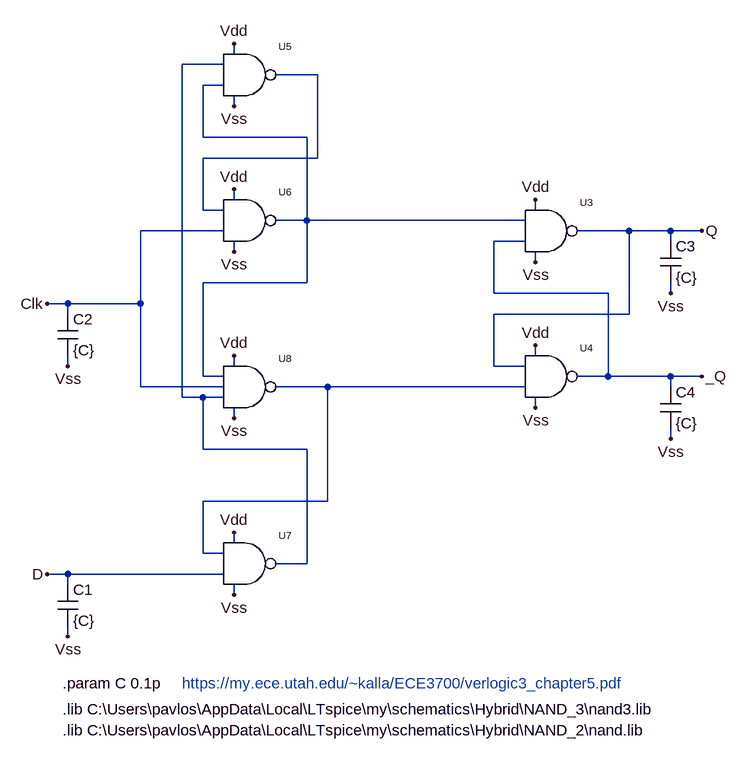
[diagram p0: schematic DFF_p.asc]
DFF_p.asc, the LTspice schematic file:
Version 4
SHEET 1 880 680
WIRE -464 -720 -464 -736
WIRE -480 -704 -544 -704
WIRE -336 -688 -400 -688
WIRE -480 -672 -512 -672
WIRE -464 -640 -464 -656
WIRE -512 -592 -512 -672
WIRE -352 -592 -512 -592
WIRE -336 -560 -336 -688
WIRE -336 -560 -512 -560
WIRE -464 -496 -464 -512
WIRE -512 -480 -512 -560
WIRE -480 -480 -512 -480
WIRE 0 -480 0 -496
WIRE -352 -464 -352 -592
WIRE -352 -464 -400 -464
WIRE -16 -464 -352 -464
WIRE -480 -448 -608 -448
WIRE 144 -448 64 -448
WIRE 208 -448 144 -448
WIRE 256 -448 208 -448
WIRE -16 -432 -64 -432
WIRE 208 -432 208 -448
WIRE -464 -416 -464 -432
WIRE 0 -400 0 -416
WIRE -352 -368 -352 -464
WIRE -352 -368 -512 -368
WIRE -64 -352 -64 -432
WIRE 112 -352 -64 -352
WIRE 208 -352 208 -368
WIRE -720 -336 -752 -336
WIRE -608 -336 -608 -448
WIRE -608 -336 -720 -336
WIRE -720 -320 -720 -336
WIRE 144 -320 144 -448
WIRE 144 -320 -64 -320
WIRE 0 -256 0 -272
WIRE -720 -240 -720 -256
WIRE -464 -240 -464 -256
WIRE -64 -240 -64 -320
WIRE -16 -240 -64 -240
WIRE -512 -224 -512 -368
WIRE -480 -224 -512 -224
WIRE 112 -224 112 -352
WIRE 112 -224 64 -224
WIRE 208 -224 112 -224
WIRE 256 -224 208 -224
WIRE -608 -208 -608 -336
WIRE -480 -208 -608 -208
WIRE -320 -208 -400 -208
WIRE -16 -208 -320 -208
WIRE 208 -208 208 -224
WIRE -544 -192 -544 -704
WIRE -512 -192 -544 -192
WIRE -480 -192 -512 -192
WIRE 0 -176 0 -192
WIRE -464 -160 -464 -176
WIRE 208 -128 208 -144
WIRE -512 -112 -512 -192
WIRE -352 -112 -512 -112
WIRE -320 -32 -320 -208
WIRE -320 -32 -512 -32
WIRE -464 32 -464 16
WIRE -512 48 -512 -32
WIRE -480 48 -512 48
WIRE -352 64 -352 -112
WIRE -352 64 -400 64
WIRE -720 80 -752 80
WIRE -480 80 -720 80
WIRE -720 96 -720 80
WIRE -464 112 -464 96
WIRE -720 176 -720 160
FLAG -464 16 Vdd
FLAG 0 -496 Vdd
FLAG -464 -256 Vdd
FLAG -464 -160 Vss
FLAG -464 112 Vss
FLAG 0 -400 Vss
FLAG -752 -336 Clk
FLAG -752 80 D
FLAG 256 -448 Q
FLAG 256 -224 _Q
FLAG -464 -736 Vdd
FLAG -464 -416 Vss
FLAG 0 -272 Vdd
FLAG -464 -640 Vss
FLAG -464 -512 Vdd
FLAG 0 -176 Vss
FLAG -720 -240 Vss
FLAG -720 176 Vss
FLAG 208 -128 Vss
FLAG 208 -352 Vss
SYMBOL nand -16 -416 R0
SYMATTR InstName U3
SYMBOL nand -16 -192 R0
SYMATTR InstName U4
SYMBOL nand -480 -656 R0
SYMATTR InstName U5
SYMBOL nand -480 -432 R0
SYMATTR InstName U6
SYMBOL nand -480 96 R0
SYMATTR InstName U7
SYMBOL nand3 -480 -176 R0
SYMATTR InstName U8
SYMBOL cap -736 96 R0
SYMATTR InstName C1
SYMATTR Value {C}
SYMBOL cap -736 -320 R0
SYMATTR InstName C2
SYMATTR Value {C}
SYMBOL cap 192 -432 R0
SYMATTR InstName C3
SYMATTR Value {C}
SYMBOL cap 192 -208 R0
SYMATTR InstName C4
SYMATTR Value {C}
TEXT -728 288 Left 2 !.lib C:\\Users\\pavlos\\AppData\\Local\\LTspice\\my\\schematics\\Hybrid\\NAND_3\\nand3.lib
TEXT -728 320 Left 2 !.lib C:\\Users\\pavlos\\AppData\\Local\\LTspice\\my\\schematics\\Hybrid\\NAND_2\\nand.lib
TEXT -728 248 Left 2 !.param C 0.1p
TEXT -544 248 Left 2 ;https://my.ece.utah.edu/~kalla/ECE3700/verlogic3_chapter5.pdf

The netlist it stands for:
* DFF_p.asc
XU3 N003 _Q Q Vdd Vss nand  ; pins A B Y Vdd Vss
XU4 Q N004 _Q Vdd Vss nand  ; pins A B Y Vdd Vss
XU5 N001 N003 N002 Vdd Vss nand  ; pins A B Y Vdd Vss
XU6 N002 Clk N003 Vdd Vss nand  ; pins A B Y Vdd Vss
XU7 N004 D N001 Vdd Vss nand  ; pins A B Y Vdd Vss
XU8 N003 Clk N001 N004 Vdd Vss nand3  ; pins A B C Y Vdd Vss
C1 D Vss {C}
C2 Clk Vss {C}
C3 Q Vss {C}
C4 _Q Vss {C}
.lib C:\Users\pavlos\AppData\Local\LTspice\my\schematics\Hybrid\NAND_3\nand3.lib
.lib C:\Users\pavlos\AppData\Local\LTspice\my\schematics\Hybrid\NAND_2\nand.lib
.param C 0.1p
* https://my.ece.utah.edu/~kalla/ECE3700/verlogic3_chapter5.pdf
.backanno
.end